# Altium schematic sheet CR99001.SchDoc
size A4; Organization: MicroFPGA UG; Revision: 00; SheetNumber: 0; SheetTotal: 0
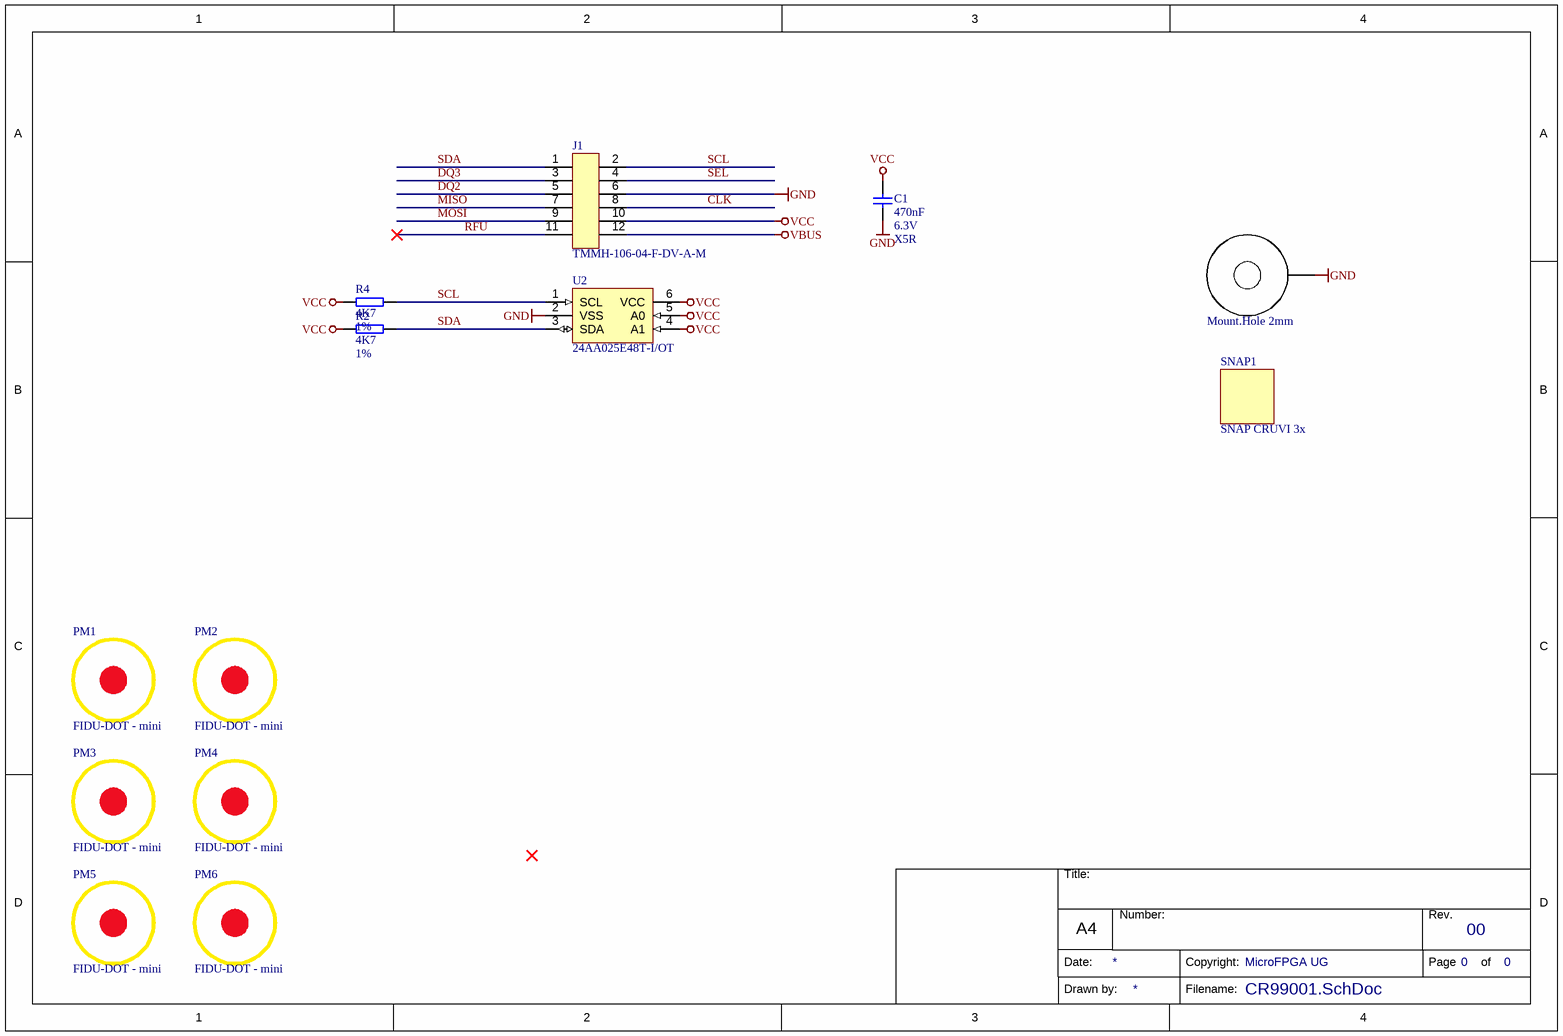
[diagram p0: CR99001.SchDoc]

## Parts
C1  470nF  Voltage: 6.3V  Technology: X5R  [CAPC1005X55N]
H1  Mount.Hole 2mm  [MHole2_2mm]  (no BOM)
J1  TMMH-106-04-F-DV-A-M  [TMMH-106-04-T-DV-A]
PM1  FIDU-DOT - mini  [FIDU-DOT - mini]
PM2  FIDU-DOT - mini  [FIDU-DOT - mini]
PM3  FIDU-DOT - mini  [FIDU-DOT - mini]
PM4  FIDU-DOT - mini  [FIDU-DOT - mini]
PM5  FIDU-DOT - mini  [FIDU-DOT - mini]
PM6  FIDU-DOT - mini  [FIDU-DOT - mini]
R2  4K7  Tolerance: 1%  [RESC1005X40N]
R4  4K7  Tolerance: 1%  [RESC1005X40N]
SNAP1  SNAP CRUVI 3x  [CRUVI_3x_Snap]  (no BOM)
U2  24AA025E48T-I/OT  [SOT95P280X145-6N]

## Nets
GND: C1.2 H1.1 J1.6 U2.2(VSS)
VBUS: J1.12
VCC: C1.1 J1.10 R2.1 R4.1 U2.4(A1) U2.5(A0) U2.6(VCC)
CLK: J1.8
DQ2: J1.5
DQ3: J1.3
MISO: J1.7
MOSI: J1.9
RFU: J1.11
SCL: J1.2 R4.2 U2.1(SCL)
SDA: J1.1 R2.2 U2.3(SDA)
SEL: J1.4

## Notes on the sheet
- Title:
- Number:
- Rev.
- Date:
- A4
- Copyright:
- Page
- of
- Drawn by:
- Filename:

## Library data of the parts
C1 = 23659: KON 470nF 6,3V X5R SMD BF 1005 (0402); AN: 23659; Mixed: SMT; Value: 470n; Preferred: Yes; Temperature-Range: -55/+85; Case: 1005 (0402)
H1 = 27273: AN: 27273; Mixed: THT
J1 = 28976: AN: 28976; Mixed: SMT; HelpURL: b:\AD\adlib\datasheet\Samtec_TMMH\; H-ART: TMMH-106-04-F-DV-A-M
PM1-PM6 = 27037: FIDU-DOT - MINI 0.5mm; AN: 27037; Mixed: FIDU
R2 R4 = 22585: WID SMD 4K7 1% 0,063W BF 1005 (0402); AN: 22585; Mixed: SMT; Value: 4.7K; Preferred: Yes; H-ART: RC0402FR-134K7L; Case: 1005 (0402); Technology: TK100
SNAP1 = 29977: SNAP for CRUVI 3x; AN: 29977
U2 = 26249: AN: 26249; Mixed: SMT; Temperature-Range: -40/+85; Case: SOT23-6; HelpURL: B:\AD\adlib\datasheet\24AA02xExx; H-ART: 24AA025E48T-I/OT